# EAGLE design Phased_Array_Ant (EAGLE 7.4.0)
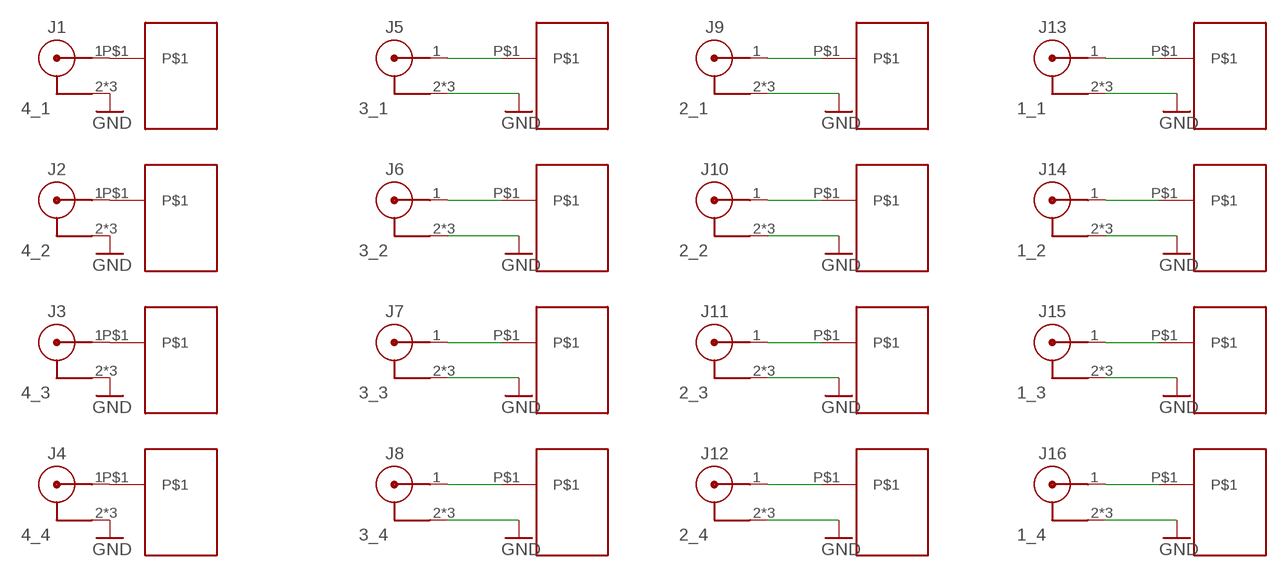
[diagram p0: schematic, sheet 1]

## Parts
J1  4_1  60124102122403  [60124102122403]
J2  4_2  60124102122403  [60124102122403]
J3  4_3  60124102122403  [60124102122403]
J4  4_4  60124102122403  [60124102122403]
J5  3_1  60124102122403  [60124102122403]
J6  3_2  60124102122403  [60124102122403]
J7  3_3  60124102122403  [60124102122403]
J8  3_4  60124102122403  [60124102122403]
J9  2_1  60124102122403  [60124102122403]
J10  2_2  60124102122403  [60124102122403]
J11  2_3  60124102122403  [60124102122403]
J12  2_4  60124102122403  [60124102122403]
J13  1_1  60124102122403  [60124102122403]
J14  1_2  60124102122403  [60124102122403]
J15  1_3  60124102122403  [60124102122403]
J16  1_4  60124102122403  [60124102122403]
U$1  10.5GHZ_ANT  [10.5GHZ_ANT]
U$2  10.5GHZ_ANT  [10.5GHZ_ANT]
U$3  10.5GHZ_ANT  [10.5GHZ_ANT]
U$4  10.5GHZ_ANT  [10.5GHZ_ANT]
U$5  10.5GHZ_ANT  [10.5GHZ_ANT]
U$6  10.5GHZ_ANT  [10.5GHZ_ANT]
U$7  10.5GHZ_ANT  [10.5GHZ_ANT]
U$8  10.5GHZ_ANT  [10.5GHZ_ANT]
U$9  10.5GHZ_ANT  [10.5GHZ_ANT]
U$10  10.5GHZ_ANT  [10.5GHZ_ANT]
U$11  10.5GHZ_ANT  [10.5GHZ_ANT]
U$12  10.5GHZ_ANT  [10.5GHZ_ANT]
U$13  10.5GHZ_ANT  [10.5GHZ_ANT]
U$14  10.5GHZ_ANT  [10.5GHZ_ANT]
U$15  10.5GHZ_ANT  [10.5GHZ_ANT]
U$16  10.5GHZ_ANT  [10.5GHZ_ANT]

## Nets
GND: J1.2 J1.3 J1.4 J2.2 J2.3 J2.4 J3.2 J3.3 J3.4 J4.2 J4.3 J4.4 J5.2 J5.3 J5.4 J6.2 J6.3 J6.4 J7.2 J7.3 J7.4 J8.2 J8.3 J8.4 J9.2 J9.3 J9.4 J10.2 J10.3 J10.4 J11.2 J11.3 J11.4 J12.2 J12.3 J12.4 J13.2 J13.3 J13.4 J14.2 J14.3 J14.4 J15.2 J15.3 J15.4 J16.2 J16.3 J16.4
N$1: J1.1 U$1.P$1
N$2: J2.1 U$2.P$1
N$3: J3.1 U$3.P$1
N$4: J4.1 U$4.P$1
N$5: J5.1 U$5.P$1
N$6: J6.1 U$6.P$1
N$7: J7.1 U$7.P$1
N$8: J8.1 U$8.P$1
N$9: J9.1 U$9.P$1
N$10: J10.1 U$10.P$1
N$11: J11.1 U$11.P$1
N$12: J12.1 U$12.P$1
N$13: J13.1 U$13.P$1
N$14: J14.1 U$14.P$1
N$15: J15.1 U$15.P$1
N$16: J16.1 U$16.P$1

## Library data of the parts
J1-J16 = Eagle_WR-SMP_rev21a:60124102122403: WR-SMP Straight MATERIAL PROPERTIES Insulator Material LCP Center Contact Material Brass Center Contact Plating Gold, min. 0.127 μm over Nickel Body Material Brass Body Plating Gold, min. 0.127 μm over Nickel KIND PROPERTIES Interface MIL-STD-348 Connector Type SMP Gender Plug Orientation Type Straight GENERAL INFORMATION Operating Temperature -65 up to +165 °C ELECTRICAL PROPERTIES f DC~12 GHz MECHANICAL PROPERTIES Mating Cycle 500 Cycles; 1000 Cycles PACKAGING PROPERTIES Packaging Tray <https://www.we-online.com/catalog/media/o176648v209%20Family_WR-SMP_60114102122403.jpg> Details see: https://www.we-online.com/catalog/en/SMP_SMT_STRAIGHT/ Updated by Ella Wu 2020-05-29 2020(C) Würth Elektronik; DATASHEET-URL: https://www.we-online.com/catalog/datasheet/60124102122403.pdf; GENDER: Plug; INTERFACE: MIL-STD-348; MOUNT: SMT; ORIENTATION-TYPE: Straight; PART-NUMBER: 60124102122403; VALUE: 60124102122403; Z: 50Ohm
U$1-U$16 = My_Library_RADAR:10.5GHZ_ANT

## Board
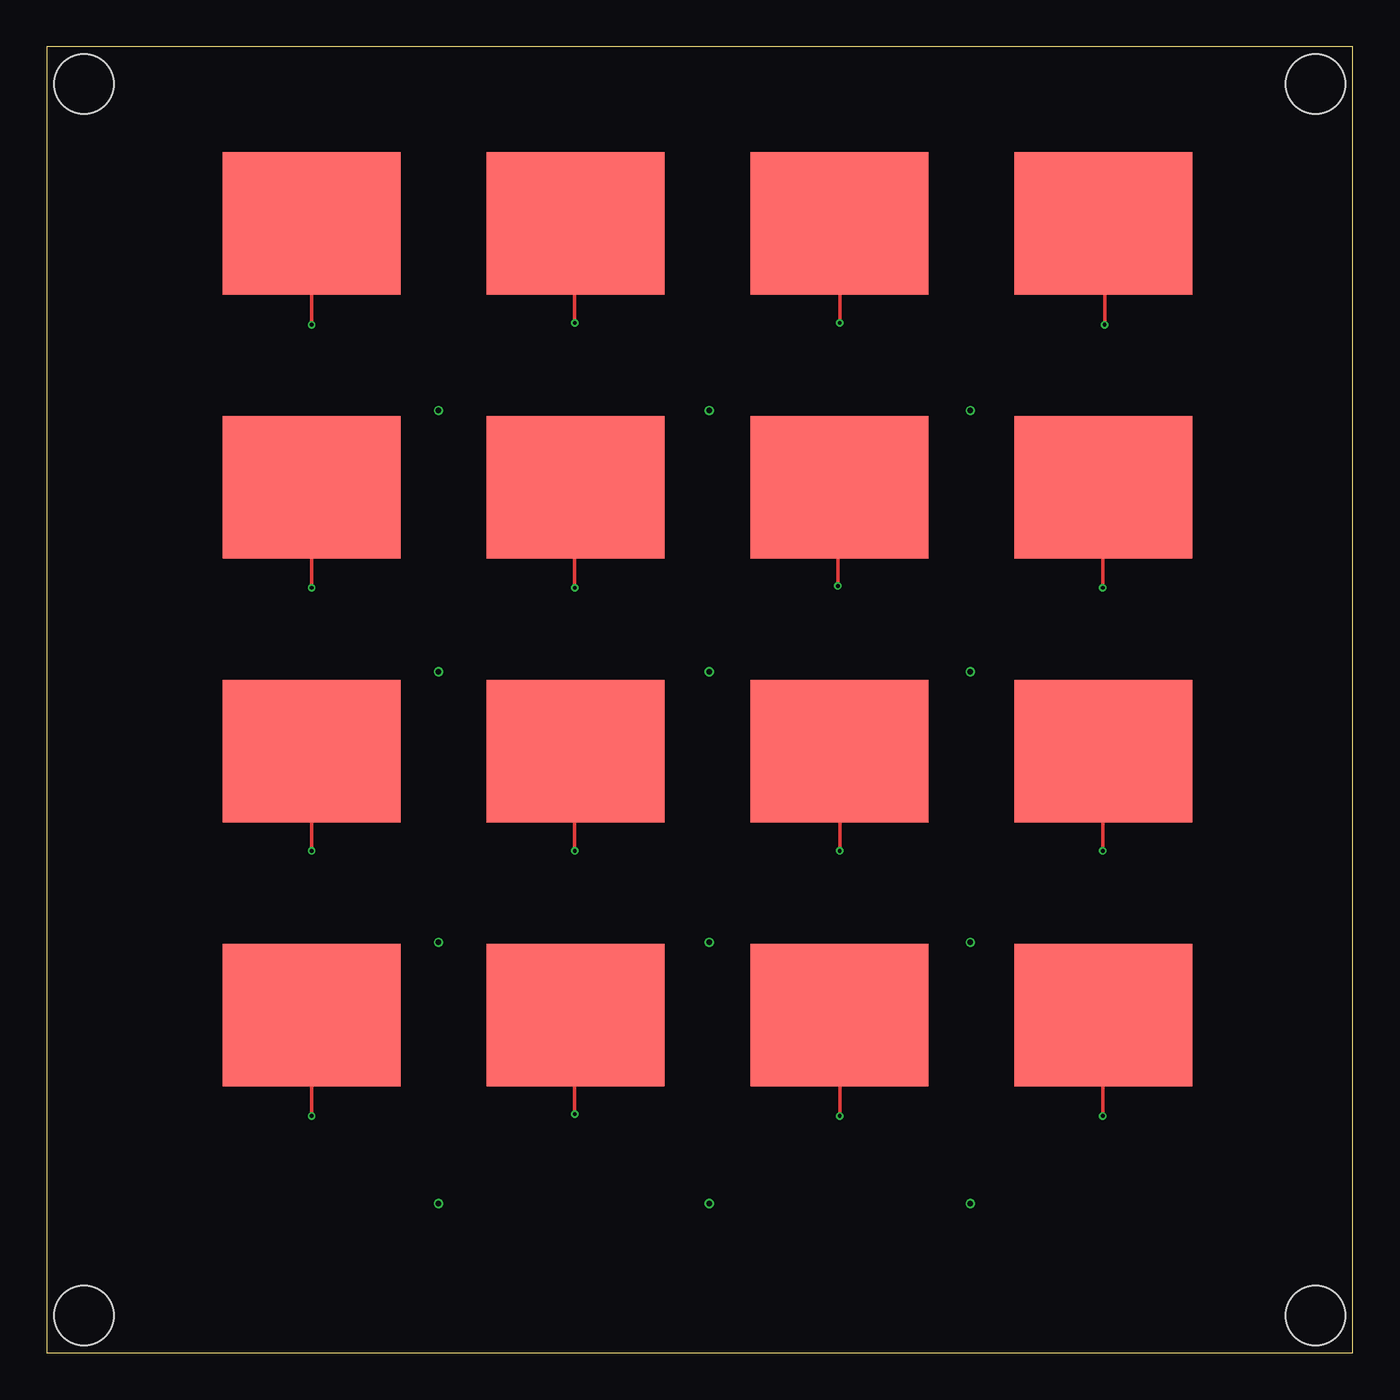
[diagram p1: board, top side]
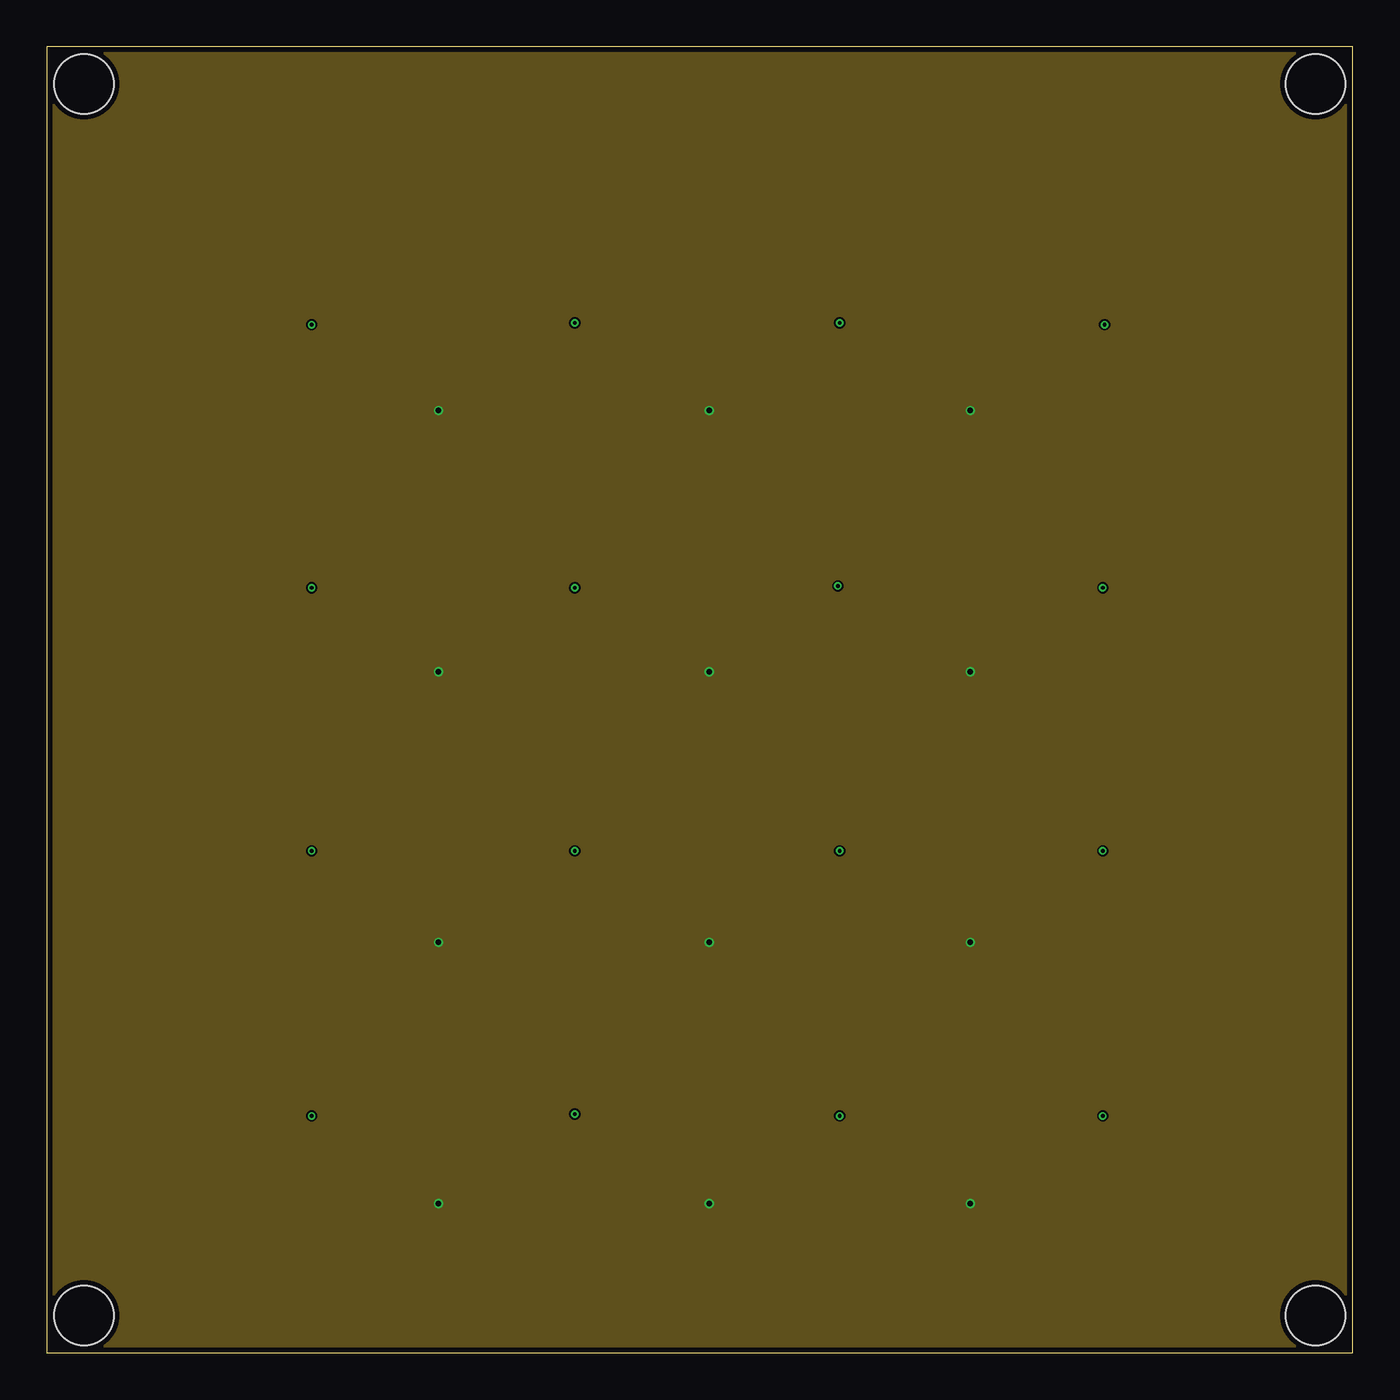
[diagram p2: board, inner layer Route2]
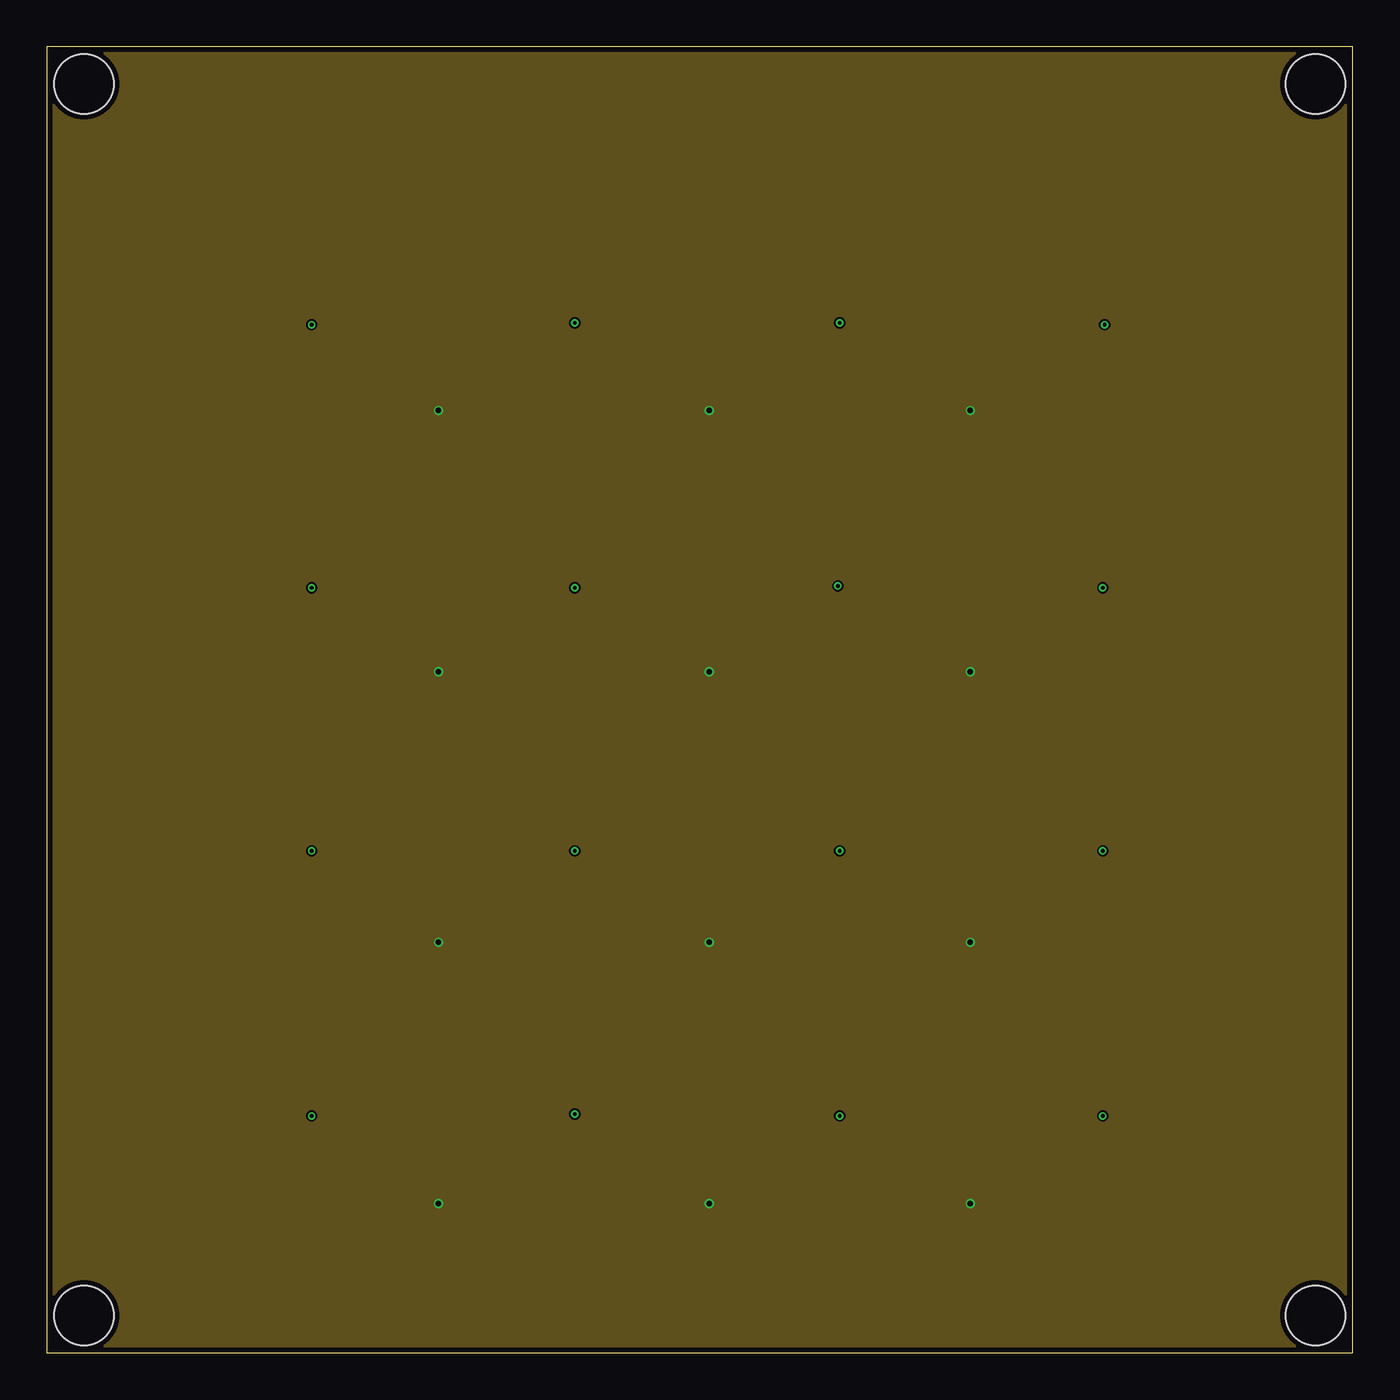
[diagram p3: board, inner layer Route15]
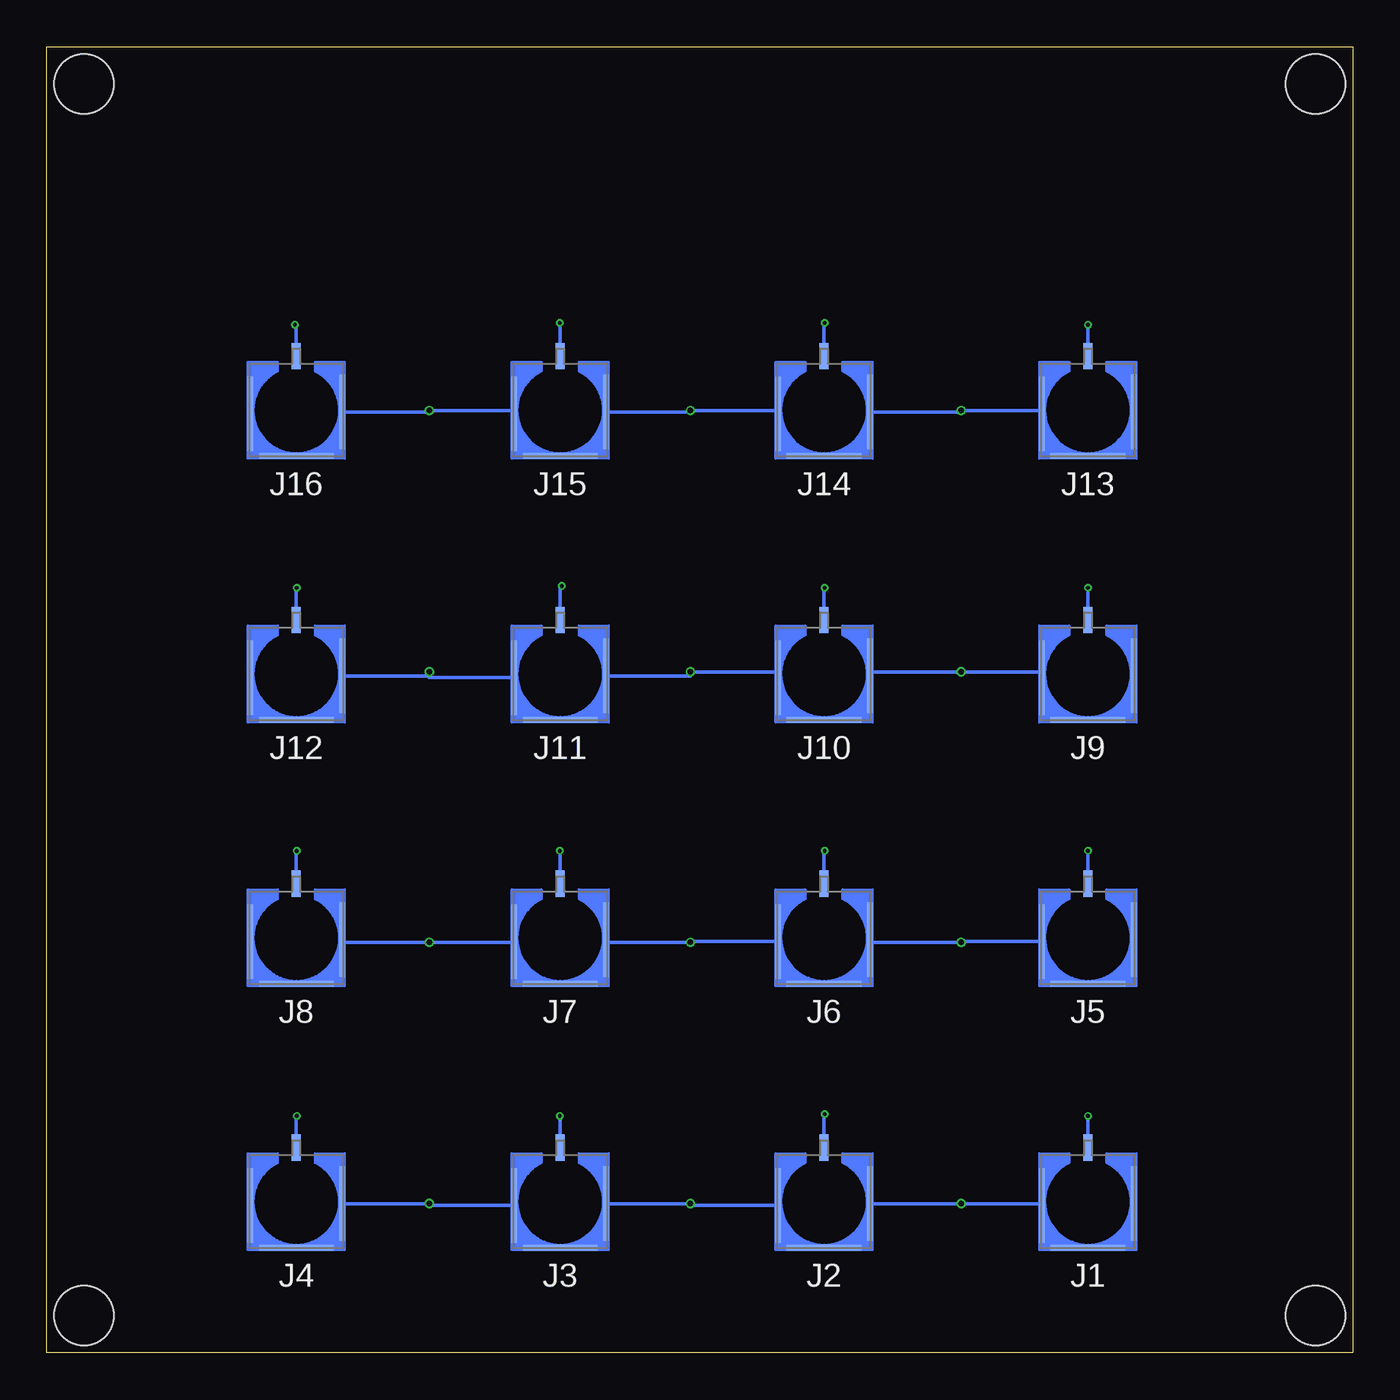
[diagram p4: board, bottom side, seen from below]

Size 70 x 70 mm. Coordinates in mm from the lower left corner, seen from the top.
Outline: 0,0 70,0 70,70 0,70 0,0
Copper layers (1+2*3+14*15+16): Top 0.035mm / dielectric 0.11mm / Route2 0.035mm / dielectric 0.6mm / Route3 0.035mm / dielectric 0.11mm / Route14 0.035mm / dielectric 0.6mm / Route15 0.035mm / dielectric 0.11mm / Bottom 0.035mm
Design rules "PCBWay_6L_100um-Track": minimum track width 0.1mm, minimum drill 0.3mm, track to track 0.1mm, track to pad 0.1mm, pad to pad 0.1mm, via to via 0.1mm, smd to smd 0mil, copper to edge 0.3mm, drill to drill 10mil, minimum pad ring 6mil, minimum via ring 0.1mm, stop-mask expansion 2mil, vias tented up to drill 0.45mm, thermal gap 0.2mm
Holes 3.2 mm at 2,2 68,2 68,68 2,68

### Footprints (pad centres in the part's own frame; a part is rotated, then mirrored left to right if it is on the bottom)
60124102122403 = smd 0.48 x 1.4: 1 0,-2.9 | smd 0.3 x 4: 2 -2.45,0.1; 4 2.45,0.2 | smd 4 x 0.3: 3 0,2.45
10.5GHZ_ANT = smd 9.538 x 7.636: P$1 0,0

### Placement (x,y rotation side)
J1  14.2,8.1 180 bottom
J2  28.34,8.1 180 bottom
J3  42.48,8.1 180 bottom
J4  56.62,8.1 180 bottom
J5  14.2,22.24 180 bottom
J6  28.34,22.24 180 bottom
J7  42.48,22.24 180 bottom
J8  56.62,22.24 180 bottom
J9  14.2,36.38 180 bottom
J10  28.34,36.38 180 bottom
J11  42.48,36.38 180 bottom
J12  56.62,36.38 180 bottom
J13  14.2,50.52 180 bottom
J14  28.34,50.52 180 bottom
J15  42.48,50.52 180 bottom
J16  56.62,50.52 180 bottom
U$1  14.2,18.1 0 top
U$2  28.34,18.1 0 top
U$3  42.48,18.1 0 top
U$4  56.62,18.1 0 top
U$5  14.2,32.24 0 top
U$6  28.34,32.24 0 top
U$7  42.48,32.24 0 top
U$8  56.62,32.24 0 top
U$9  14.2,46.38 0 top
U$10  28.34,46.38 0 top
U$11  42.48,46.38 0 top
U$12  56.62,46.38 0 top
U$13  14.2,60.52 0 top
U$14  28.34,60.52 0 top
U$15  42.48,60.52 0 top
U$16  56.62,60.52 0 top

### Tracks (layer width: path | path; a pad name or v marks a point on that pad's centre or on a via)
GND  (via drill 0.3)
  Bottom 0.2: J1.4 16.65,8 v21,8 J2.2 | J13.4 16.65,50.5 v21,50.5 21,50.42 J14.2 | J14.4 30.79,50.5 v35.5,50.5 35.5,50.42 J15.2 | J16.2 49.5,50.42 v49.5,50.5 44.93,50.5 J15.4 | J9.4 16.65,36.5 v21,36.5 25.89,36.5 J10.2 | J10.4 30.79,36.5 v35.5,36.5 35.5,36.28 J11.2 | J12.2 49.5,36.28 v49.5,36.5 49.5,36.18 J11.4 | J8.2 54.17,22 v49.5,22 44.93,22 J7.4 | J7.2 40.03,22 v35.5,22 35.5,22.04 J6.4 | J5.4 21,22.04 v21,22 25.89,22 J6.2 | J2.4 35.5,7.9 v35.5,8 J3.2 | J3.4 49.5,7.9 v49.5,8 J4.2
  pour Route2: 0,70 70,70 70,0 0,0
  pour Route15: 0,70 70,70 70,0 0,0
N$1  (via drill 0.2)
  Top 0.2: v14.2,12.7 U$1.P$1
  Bottom 0.2: J1.1 v14.2,12.7
N$2  (via drill 0.2)
  Top 0.2: v28.3,12.8 28.3,18.1 U$2.P$1
  Bottom 0.2: J2.1 28.34,12.8 v28.3,12.8
N$3  (via drill 0.2)
  Top 0.2: v42.5,12.7 42.5,18.1 U$3.P$1
  Bottom 0.2: J3.1 42.48,12.7 v42.5,12.7
N$4  (via drill 0.2)
  Top 0.2: v56.6,12.7 56.6,18.1 U$4.P$1
  Bottom 0.2: J4.1 56.62,12.7 v56.6,12.7
N$5  (via drill 0.2)
  Top 0.2: v14.2,26.9 U$5.P$1
  Bottom 0.2: J5.1 v14.2,26.9
N$6  (via drill 0.2)
  Top 0.2: v28.3,26.9 28.3,32.24 U$6.P$1
  Bottom 0.2: J6.1 28.34,26.9 v28.3,26.9
N$7  (via drill 0.2)
  Top 0.2: v42.5,26.9 42.5,32.24 U$7.P$1
  Bottom 0.2: J7.1 42.48,26.9 v42.5,26.9
N$8  (via drill 0.2)
  Top 0.2: v56.6,26.9 56.6,32.24 U$8.P$1
  Bottom 0.2: J8.1 56.62,26.9 v56.6,26.9
N$9  (via drill 0.2)
  Top 0.2: v14.2,41 U$9.P$1
  Bottom 0.2: J9.1 v14.2,41
N$10  (via drill 0.2)
  Top 0.2: v28.3,41 28.3,46.38 U$10.P$1
  Bottom 0.2: J10.1 28.34,41 v28.3,41
N$11  (via drill 0.2)
  Top 0.2: v42.4,41.1 42.4,46.38 U$11.P$1
  Bottom 0.2: J11.1 42.48,41.1 v42.4,41.1
N$12  (via drill 0.2)
  Top 0.2: v56.6,41 56.6,46.38 U$12.P$1
  Bottom 0.2: J12.1 56.62,41 v56.6,41
N$13  (via drill 0.2)
  Top 0.2: v14.2,55.1 U$13.P$1
  Bottom 0.2: J13.1 v14.2,55.1
N$14  (via drill 0.2)
  Top 0.2: v28.3,55.2 28.3,60.52 U$14.P$1
  Bottom 0.2: J14.1 28.34,55.2 v28.3,55.2
N$15  (via drill 0.2)
  Top 0.2: v42.5,55.2 42.5,60.52 U$15.P$1
  Bottom 0.2: J15.1 42.48,55.2 v42.5,55.2
N$16  (via drill 0.2)
  Top 0.2: v56.7,55.1 56.7,60.52 U$16.P$1
  Bottom 0.2: J16.1 56.62,55.1 v56.7,55.1